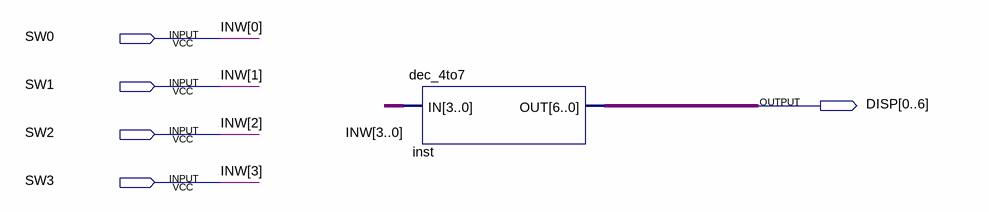
[diagram p0: schematic sheet]
// Quartus schematic start_2_3.bdf as structural Verilog: 1 symbols, 5 pins
module start_2_3 (
  input  SW0,
  input  SW1,
  input  SW2,
  input  SW3,
  output [0:6] DISP
);

  dec_4to7 inst (.IN({SW3, SW2, SW1, SW0}), .OUT(DISP));

  // Other names for the same wires on the sheet: INW[3:0] = {SW3, SW2, SW1, SW0}
endmodule
